# Altium schematic sheet CH32V317W-R0-1v0.SchDoc
size 457 x 287 mm; SheetNumber: 1; SheetTotal: 1
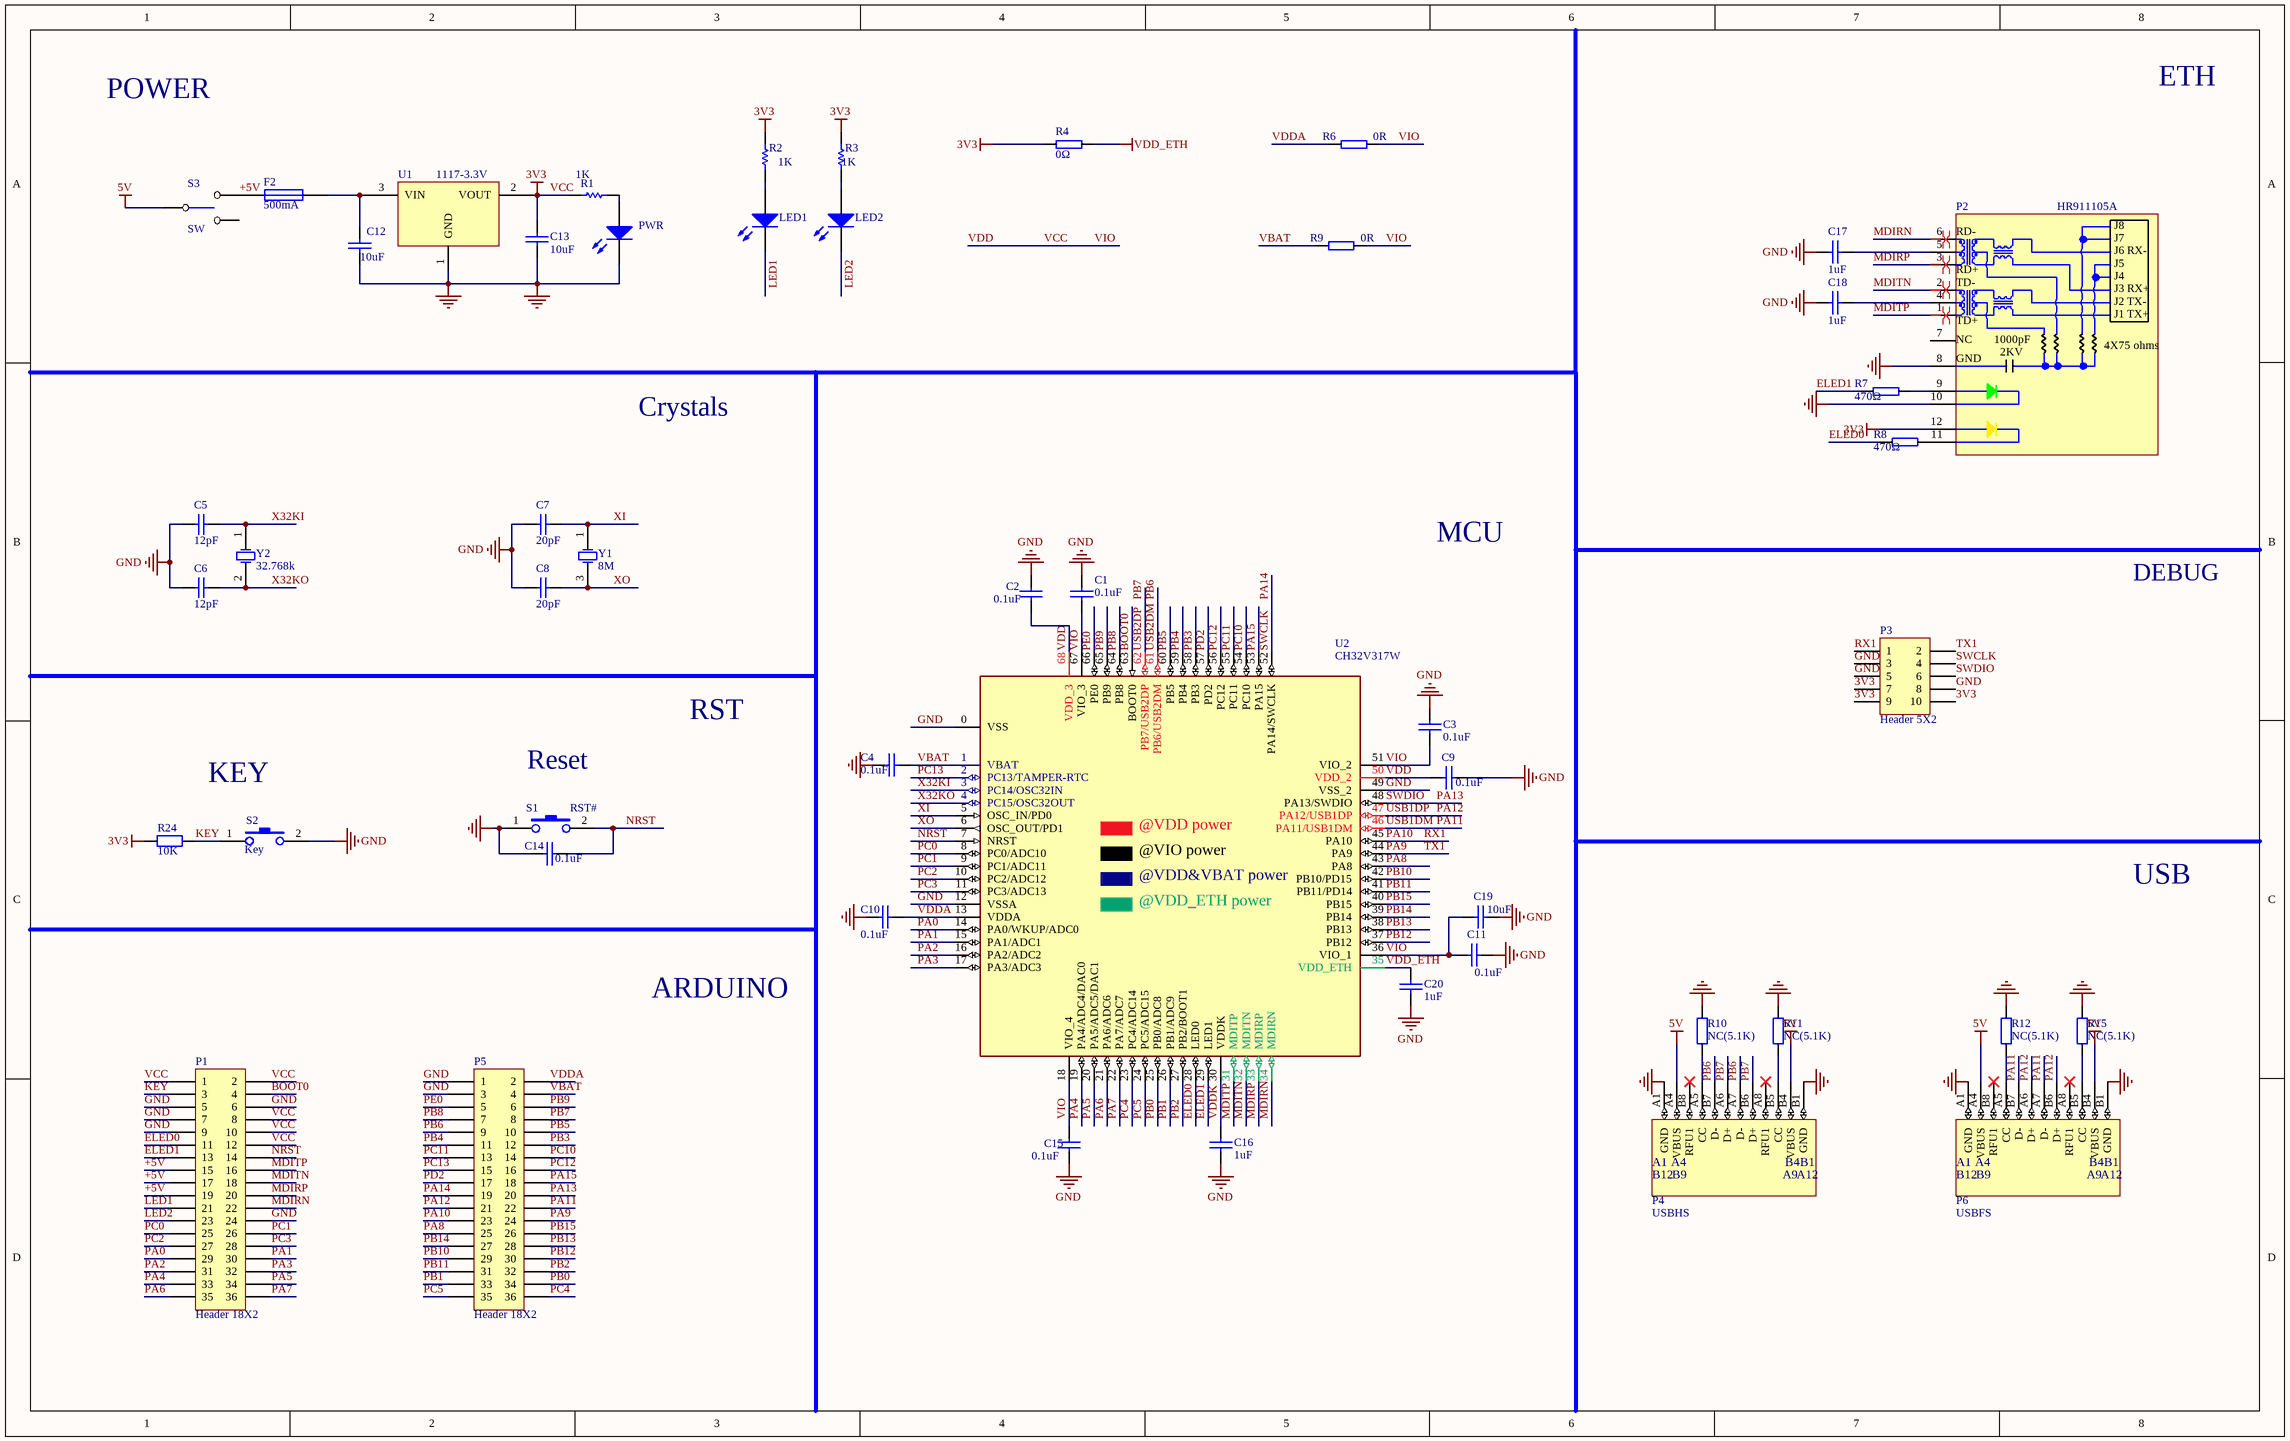
[diagram p0: CH32V317W-R0-1v0.SchDoc]

## Parts
C1  0.1uF  [0603_C]
C2  0.1uF  [0603_C]
C3  0.1uF  [0603_C]
C4  0.1uF  [0603_C]
C5  12pF  [0603_C]
C6  12pF  [0603_C]
C7  20pF  [0603_C]
C8  20pF  [0603_C]
C9  0.1uF  [0603_C]
C10  0.1uF  [0603_C]
C11  0.1uF  [0603_C]
C12  10uF  [0603_C]
C13  10uF  [0603_C]
C14  0.1uF  [0603_C]
C15  0.1uF  [0603_C]
C16  1uF  [0603_C]
C17  1uF  [0603_C]
C18  1uF  [0603_C]
C19  10uF  [0603_C]
C20  1uF  [0603_C]
F2  500mA  [0603]
LED1  LED1   blue  [0603+]  (value not drawn)
LED2  LED2  blue  [0603+]  (value not drawn)
P1  Header 18X2  [IDC36-2.54mm]
P2  HR911105A  [HR911105A]
P3  Header 5X2  [IDC10-2.54mm]
P4  USBHS  [TYPE-C-Receptacle-2.0]
P5  Header 18X2  [IDC36-2.54mm]
P6  USBFS  [TYPE-C-Receptacle-2.0]
PWR  POWER  red  [0603+]  (value not drawn)
R1  1K  [0603]
R2  1K  [0603]
R3  1K  [0603]
R4  0Ω  [0603]
R6  0R  [0603]
R7  470Ω  [0603]
R8  470Ω  [0603]
R9  0R  [0603]
R10  NC(5.1K)  [0603]
R11  NC(5.1K)  [0603]
R12  NC(5.1K)  [0603]
R15  NC(5.1K)  [0603]
R24  10K  [0603]
S1  RST#  [SMD_6.1x3.65x2.5mm-KEY]
S2  Key  [SMD_6.1x3.65x2.5mm-KEY]
S3  SW  [SW1]
U1  1117-3.3V  [SOT-223]
U2  CH32V317W  [QFN68_8X8]
Y1  8M  [XT3225]
Y2  32.768k  [FC-135]

## Nets
3V3: C1.2 C2.2 C3.2 C9.2 C11.2 C13.1 C15.2 C19.2 P1.1 P1.2 P1.8 P1.10 P1.12 P2.12 P3.7 P3.9 P3.10 R1.2 R2.1 R3.1 R4.2 R6.1 R9.1 R24.2 U1.2(VOUT) U2.18(VIO_4) U2.36(VIO_1) U2.50(VDD_2) U2.51(VIO_2) U2.67(VIO_3) U2.68(VDD_3)  [also labelled VCC, VDD, VIO]
5V: P4.A4(VBUS) P4.B4(VBUS) P6.A4(VBUS) P6.B4(VBUS) S3.1
GND: C1.1 C2.1 C3.1 C4.1 C5.2 C6.2 C7.1 C8.1 C9.1 C10.2 C11.1 C12.2 C13.2 C14.1 C15.1 C16.1 C17.1 C18.1 C19.1 C20.1 P1.5 P1.6 P1.7 P1.9 P1.24 P2.8 P2.10 P3.3 P3.5 P3.8 P4.A1(GND) P4.B1(GND) P5.1 P5.3 P6.A1(GND) P6.B1(GND) PWR.2(K) R10.1 R11.1 R12.1 R15.1 S1.1 S2.2 U1.1(GND) U2.0(VSS) U2.12(VSSA) U2.49(VSS_2)
VDD_ETH: C20.2 R4.1 U2.35(VDD_ETH)
+5V: F2.1 P1.15 P1.17 P1.19 S3.3
BOOT0: P1.4 U2.63(BOOT0)
ELED0: P1.11 R8.1 U2.28(LED0)
ELED1: P1.13 R7.1 U2.29(LED1)
KEY: P1.3 R24.1 S2.1
LED1: LED1.2(K) P1.21
LED2: LED2.2(K) P1.23
MDIRN: P1.22 P2.6 U2.34(MDIRN)
MDIRP: P1.20 P2.3 U2.33(MDIRP)
MDITN: P1.18 P2.2 U2.32(MDITN)
MDITP: P1.16 P2.1 U2.31(MDITP)
NRST: C14.2 P1.14 S1.2 U2.7(NRST)
PA0: P1.29 U2.14(PA0/WKUP/ADC0)
PA1: P1.30 U2.15(PA1/ADC1)
PA2: P1.31 U2.16(PA2/ADC2)
PA3: P1.32 U2.17(PA3/ADC3)
PA4: P1.33 U2.19(PA4/ADC4/DAC0)
PA5: P1.34 U2.20(PA5/ADC5/DAC1)
PA6: P1.35 U2.21(PA6/ADC6)
PA7: P1.36 U2.22(PA7/ADC7)
PA8: P5.25 U2.43(PA8)
PA9: P3.2 P5.24 U2.44(PA9)  [also labelled TX1]
PA10: P3.1 P5.23 U2.45(PA10)  [also labelled RX1]
PA11: P5.22 P6.A7(D-) P6.B7(D-) U2.46(PA11/USB1DM)  [also labelled USB1DM]
PA12: P5.21 P6.A6(D+) P6.B6(D+) U2.47(PA12/USB1DP)  [also labelled USB1DP]
PA13: P3.6 P5.20 U2.48(PA13/SWDIO)  [also labelled SWDIO]
PA14: P3.4 P5.19 U2.52(PA14/SWCLK)  [also labelled SWCLK]
PA15: P5.18 U2.53(PA15)
PB0: P5.34 U2.25(PB0/ADC8)
PB1: P5.33 U2.26(PB1/ADC9)
PB2: P5.32 U2.27(PB2/BOOT1)
PB3: P5.12 U2.58(PB3)
PB4: P5.11 U2.59(PB4)
PB5: P5.10 U2.60(PB5)
PB6: P4.A7(D-) P4.B7(D-) P5.9 U2.61(PB6/USB2DM)  [also labelled USB2DM]
PB7: P4.A6(D+) P4.B6(D+) P5.8 U2.62(PB7/USB2DP)  [also labelled USB2DP]
PB8: P5.7 U2.64(PB8)
PB9: P5.6 U2.65(PB9)
PB10: P5.29 U2.42(PB10/PD15)
PB11: P5.31 U2.41(PB11/PD14)
PB12: P5.30 U2.37(PB12)
PB13: P5.28 U2.38(PB13)
PB14: P5.27 U2.39(PB14)
PB15: P5.26 U2.40(PB15)
PC0: P1.25 U2.8(PC0/ADC10)
PC1: P1.26 U2.9(PC1/ADC11)
PC2: P1.27 U2.10(PC2/ADC12)
PC3: P1.28 U2.11(PC3/ADC13)
PC4: P5.36 U2.23(PC4/ADC14)
PC5: P5.35 U2.24(PC5/ADC15)
PC10: P5.14 U2.54(PC10)
PC11: P5.13 U2.55(PC11)
PC12: P5.16 U2.56(PC12)
PC13: P5.15 U2.2(PC13/TAMPER-RTC)
PD2: P5.17 U2.57(PD2)
PE0: P5.5 U2.66(PE0)
VBAT: C4.2 P5.4 R9.2 U2.1(VBAT)
VDDA: C10.1 P5.2 R6.2 U2.13(VDDA)
VDDK: C16.2 U2.30(VDDK)
X32KI: C5.1 U2.3(PC14/OSC32IN) Y2.1(OSC1)
X32KO: C6.1 U2.4(PC15/OSC32OUT) Y2.2(OSC2)
XI: C7.2 U2.5(OSC_IN/PD0) Y1.1(OSC1)
XO: C8.2 U2.6(OSC_OUT/PD1) Y1.3(OSC2)
NetC12_1: C12.1 F2.2 U1.3(VIN)
NetC17_2: C17.2 P2.5
NetC18_2: C18.2 P2.4
NetLED1_1: LED1.1(A) R2.2
NetLED2_1: LED2.1(A) R3.2
NetP2_9: P2.9 R7.2
NetP2_11: P2.11 R8.2
NetP4_A5: P4.A5(CC) R10.2
NetP4_B5: P4.B5(CC) R11.2
NetP6_A5: P6.A5(CC) R12.2
NetP6_B5: P6.B5(CC) R15.2
NetPWR_1: PWR.1(A) R1.1

Not connected (* = marked no-connect by the designer): P2 7; P4 A8(RFU1)* B8(RFU1)*; P6 A8(RFU1)* B8(RFU1)*; S3 2

## Layout directives
differential pair: MDIRN, MDIRP, MDITN, MDITP

## Notes on the sheet
- POWER
- ETH
- Crystals
- MCU
- DEBUG
- RST
- KEY
- Reset
- USB
- ARDUINO
- Title
- Size:
- Date:
- A3
- Number:
- Time:
- Revision:
- Sheet
- of
- File:
- (in symbol CH32V317W) @VDD power; @VIO power; @VDD&VBAT power; @VDD_ETH power
- (in symbol HR911105A) J8; RD-; J7; J6; RX-; J5; RD+; J4; TD-; J3; RX+; J2; TX-; J1; TX+; TD+; NC; 1000pF; 4X75 ohms; 2KV; GND
- (in symbol TYPE-C1) B12; B9; A9; A12

## Library data of the parts
C1-C4 C9-C20 = CAP: Capacitor
C5-C8 = Cap: Capacitor
F2 = FUSE1: Fuse
LED1 LED2 PWR = LED0: Typical INFRARED GaAs LED; Published: 8-Jun-2000; LatestRevisionDate: 08-Jul-2005; LatestRevisionNote: Mech Layer 1 removed.; PackageReference: LED-0; Publisher: Altium Limited
P1 P5 = Header 18X2: Header, 18-Pin, Dual row; LatestRevisionDate: 17-Jul-2002; LatestRevisionNote: Re-released for DXP Platform.; Publisher: Altium Limited
P3 = Header 5X2: Header, 5-Pin, Dual row; LatestRevisionDate: 17-Jul-2002; LatestRevisionNote: Re-released for DXP Platform.; Publisher: Altium Limited
P4 P6 = TYPE-C1
R1-R3 = Res Semi: Semiconductor Resistor
R4 R7 R8 = RES
R6 R9 = R
R10-R12 R15 R24 = Res2: Resistor
S1 S2 = KEY1
U2 = CH32V317W: RISC-V FPU HD-MCU, 144MHz, USB_480M, USB OTG, 100M Ethernet & Phy, 2*CAN
Y1 Y2 = XTAL: Crystal Oscillator; Published: 8-Jun-2000; LatestRevisionDate: 17-Jul-2002; LatestRevisionNote: Re-released for DXP Platform.; PackageReference: R38; Publisher: Altium Limited